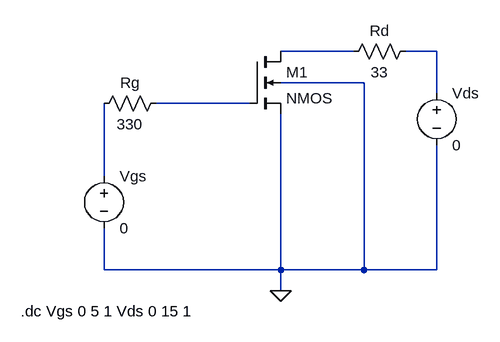
[diagram p0: schematic IDvsVDS.asc]
IDvsVDS.asc, the LTspice schematic file:
Version 4.1
SHEET 1 880 680
WIRE 224 64 112 64
WIRE 352 64 304 64
WIRE 240 112 112 112
WIRE 352 128 352 64
WIRE 64 144 -80 144
WIRE -160 256 -160 144
WIRE -160 400 -160 336
WIRE 112 400 112 160
WIRE 112 400 -160 400
WIRE 240 400 240 112
WIRE 240 400 112 400
WIRE 352 400 352 208
WIRE 352 400 240 400
WIRE 112 432 112 400
FLAG 112 432 0
SYMBOL nmos4 64 64 R0
SYMATTR InstName M1
SYMATTR Value2 l=20u w=100u
SYMBOL voltage 352 112 R0
SYMATTR InstName Vds
SYMATTR Value 0
SYMBOL voltage -160 240 R0
SYMATTR InstName Vgs
SYMATTR Value 0
SYMBOL res -64 128 R90
WINDOW 0 0 56 VBottom 2
WINDOW 3 32 56 VTop 2
SYMATTR InstName Rg
SYMATTR Value 330
SYMBOL res 320 48 R90
WINDOW 0 0 56 VBottom 2
WINDOW 3 32 56 VTop 2
SYMATTR InstName Rd
SYMATTR Value 33
TEXT -288 464 Left 2 !.dc Vgs 0 5 1 Vds 0 15 1

The netlist it stands for:
* IDvsVDS.asc
M1 N001 N003 0 0 NMOS l=20u w=100u
Vds N002 0 0
Vgs N004 0 0
Rg N003 N004 330
Rd N002 N001 33
.model NMOS NMOS
.model PMOS PMOS
.lib standard.mos
.dc Vgs 0 5 1 Vds 0 15 1
.backanno
.end